# EAGLE design combo - no usb - pth - tcrt5000 (EAGLE 6.5.0)
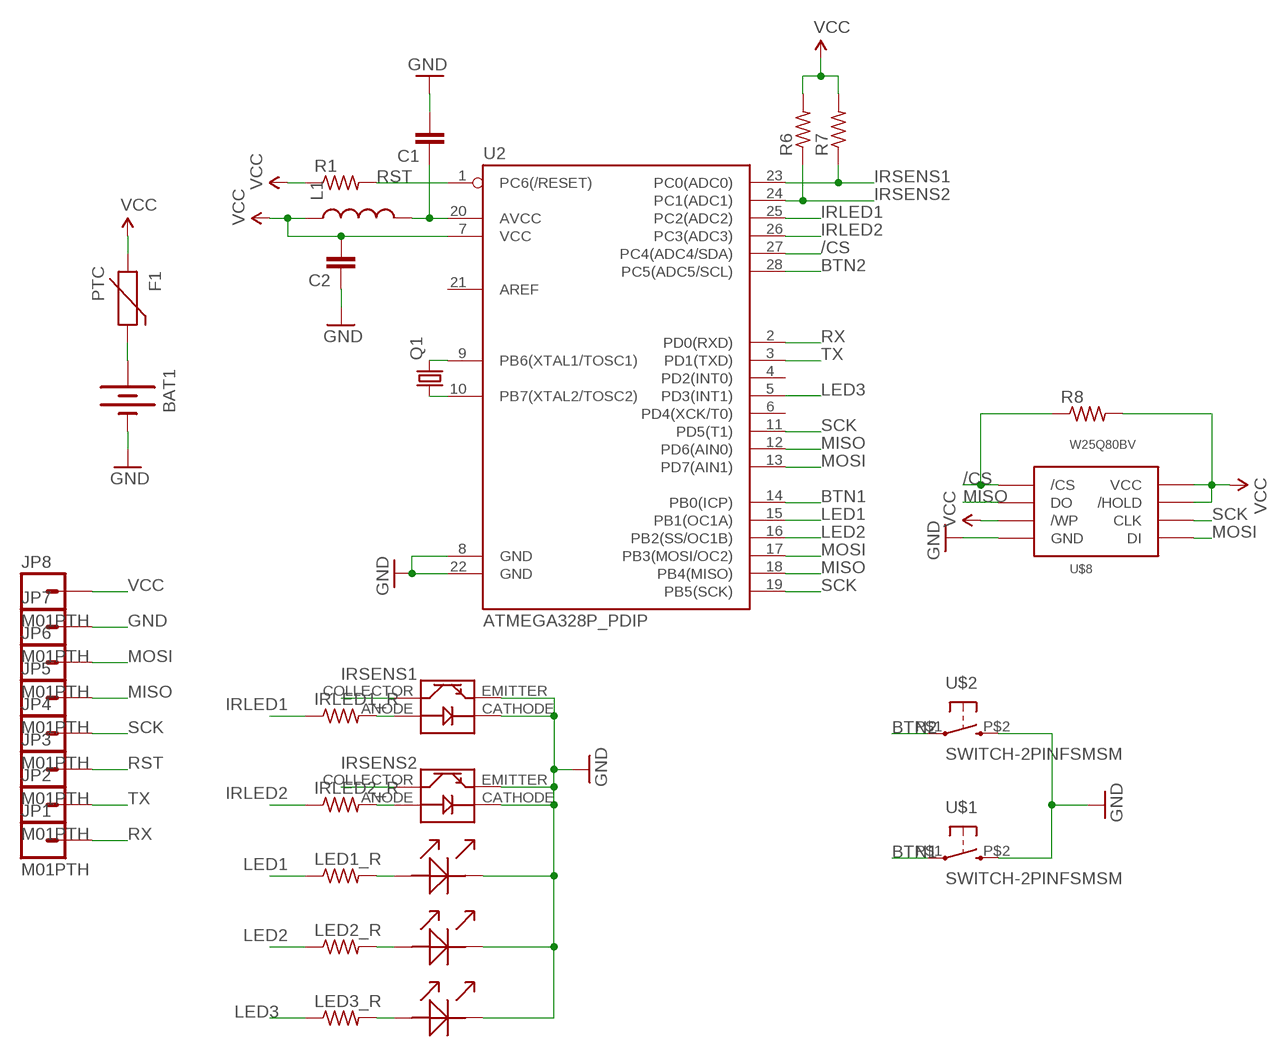
[diagram p0: schematic, sheet 1]

## Parts
BAT1  BATTERYBA2032SM  [BA2032SM]
C1  CAP0805  [0805]
C2  CAP0805  [0805]
F1  PTC  [R0805]
IRLED1_R  R-US_M0805  [M0805]
IRLED2_R  R-US_M0805  [M0805]
JP1  M01PTH  [1X01]
JP2  M01PTH  [1X01]
JP3  M01PTH  [1X01]
JP4  M01PTH  [1X01]
JP5  M01PTH  [1X01]
JP6  M01PTH  [1X01]
JP7  M01PTH  [1X01]
JP8  M01PTH  [1X01]
L1  INDUCTOR0805  [0805]
LED1_R  R-US_M0805  [M0805]
LED2_R  R-US_M0805  [M0805]
LED3_R  R-US_M0805  [M0805]
Q1  CRYSTALTC26V  [TC26V]
R1  R-US_M0805  [M0805]
R6  R-US_M0805  [M0805]
R7  R-US_M0805  [M0805]
R8  R-US_M0805  [M0805]
U2  ATMEGA328P_PDIP  [DIL28-3]
U$1  SWITCH-2PINFSMSM  [FSMSM-BUTTON]
U$2  SWITCH-2PINFSMSM  [FSMSM-BUTTON]
U$3  IR_SENSORTCRT5000  [TCRT5000]
U$4  IR_SENSORTCRT5000  [TCRT5000]
U$5  LEDPTH  [LED]
U$6  LEDPTH  [LED]
U$7  LED0603  [0603]
U$8  W25Q80BVSOIC-08  [W25Q80BV-SOIC-208MIL]

## Nets
/CS: R8.1 U2.27(PC4(ADC4/SDA)) U$8./CS
BTN1: U2.14(PB0(ICP)) U$1.P$1
BTN2: U2.28(PC5(ADC5/SCL)) U$2.P$1
GND: BAT1.- C1.2 C2.1 JP7.1 U2.8(GND) U2.22(GND) U$1.P$2 U$2.P$2 U$3.CATHODE(LED-) U$3.EMITTER U$4.CATHODE(LED-) U$4.EMITTER U$5.- U$6.- U$7.2(-) U$8.GND
IRLED1: IRLED1_R.1 U2.25(PC2(ADC2))
IRLED2: IRLED2_R.1 U2.26(PC3(ADC3))
IRSENS1: R7.1 U2.23(PC0(ADC0)) U$3.COLLECTOR
IRSENS2: R6.1 U2.24(PC1(ADC1)) U$4.COLLECTOR
LED1: LED1_R.1 U2.15(PB1(OC1A))
LED2: LED2_R.1 U2.16(PB2(SS/OC1B))
LED3: LED3_R.1 U2.5(PD3(INT1))
MISO: JP5.1 U2.12(PD6(AIN0)) U2.18(PB4(MISO)) U$8.DO
MOSI: JP6.1 U2.13(PD7(AIN1)) U2.17(PB3(MOSI/OC2)) U$8.DI
N$1: BAT1.+ F1.2
N$4: Q1.2 U2.9(PB6(XTAL1/TOSC1))
N$5: Q1.1 U2.10(PB7(XTAL2/TOSC2))
N$6: C1.1 L1.2 U2.20(AVCC)
N$7: LED3_R.2 U$7.1(+)
N$13: LED2_R.2 U$6.+
N$14: LED1_R.2 U$5.+
N$15: IRLED2_R.2 U$4.ANODE(LED+)
N$16: IRLED1_R.2 U$3.ANODE(LED+)
RST: JP3.1 R1.2 U2.1(PC6(/RESET))
RX: JP1.1 U2.2(PD0(RXD))
SCK: JP4.1 U2.11(PD5(T1)) U2.19(PB5(SCK)) U$8.CLK
TX: JP2.1 U2.3(PD1(TXD))
VCC: C2.2 F1.1 JP8.1 L1.1 R1.1 R6.2 R7.2 R8.2 U2.7(VCC) U$8./HOLD U$8./WP U$8.VCC
Unconnected: U2.4(PD2(INT0)) U2.6(PD4(XCK/T0)) U2.21(AREF)

## Library data of the parts
BAT1 = Mine:BATTERY: Battery Holders Various common sizes : AA, AAA, 20mm coin cell and 12mm coin cell.
C1 C2 = SparkFun-Capacitors:CAP: Capacitor Standard 0603 ceramic capacitor, and 0.1" leaded capacitor.
F1 = Mine:PTC: Resettable Fuse PTC Resettable Fuse. Spark Fun Electronics SKU : COM-08357
IRLED1_R IRLED2_R LED1_R LED2_R LED3_R R1 R6-R8 = rcl:R-US_: RESISTOR, American symbol
JP1-JP8 = SparkFun-Connectors:M01: Header 1 Standard 1-pin 0.1" header. Use with straight break away headers (SKU : PRT-00116), right angle break away headers (PRT-00553), swiss pins (PRT-00743), machine pins (PRT-00117), and female headers (PRT-00115).
L1 = SparkFun-Passives:INDUCTOR: Inductors Basic Inductor/Choke - 0603 and 1206. Footprints are not proven and vary greatly between part numbers. SRN6045- 33uH, 20% 1.4A SDR0403-560KL - 56uH, 10%, 500mA RMS/740mA peak
Q1 = crystal:CRYSTAL: CRYSTAL; OC_FARNELL: unknown; OC_NEWARK: unknown
U2 = SparkFun-DigitalIC:ATMEGA328P_PDIP: uC used in the Arduino 32kb flash, 1k EEPROM, 2k SRAM This is the through-hole version of this chip.
U$1 U$2 = Mine:SWITCH-2PIN
U$3 U$4 = Mine:IR_SENSOR
U$5-U$7 = Mine:LED
U$8 = Mine:W25Q80BV

## Board
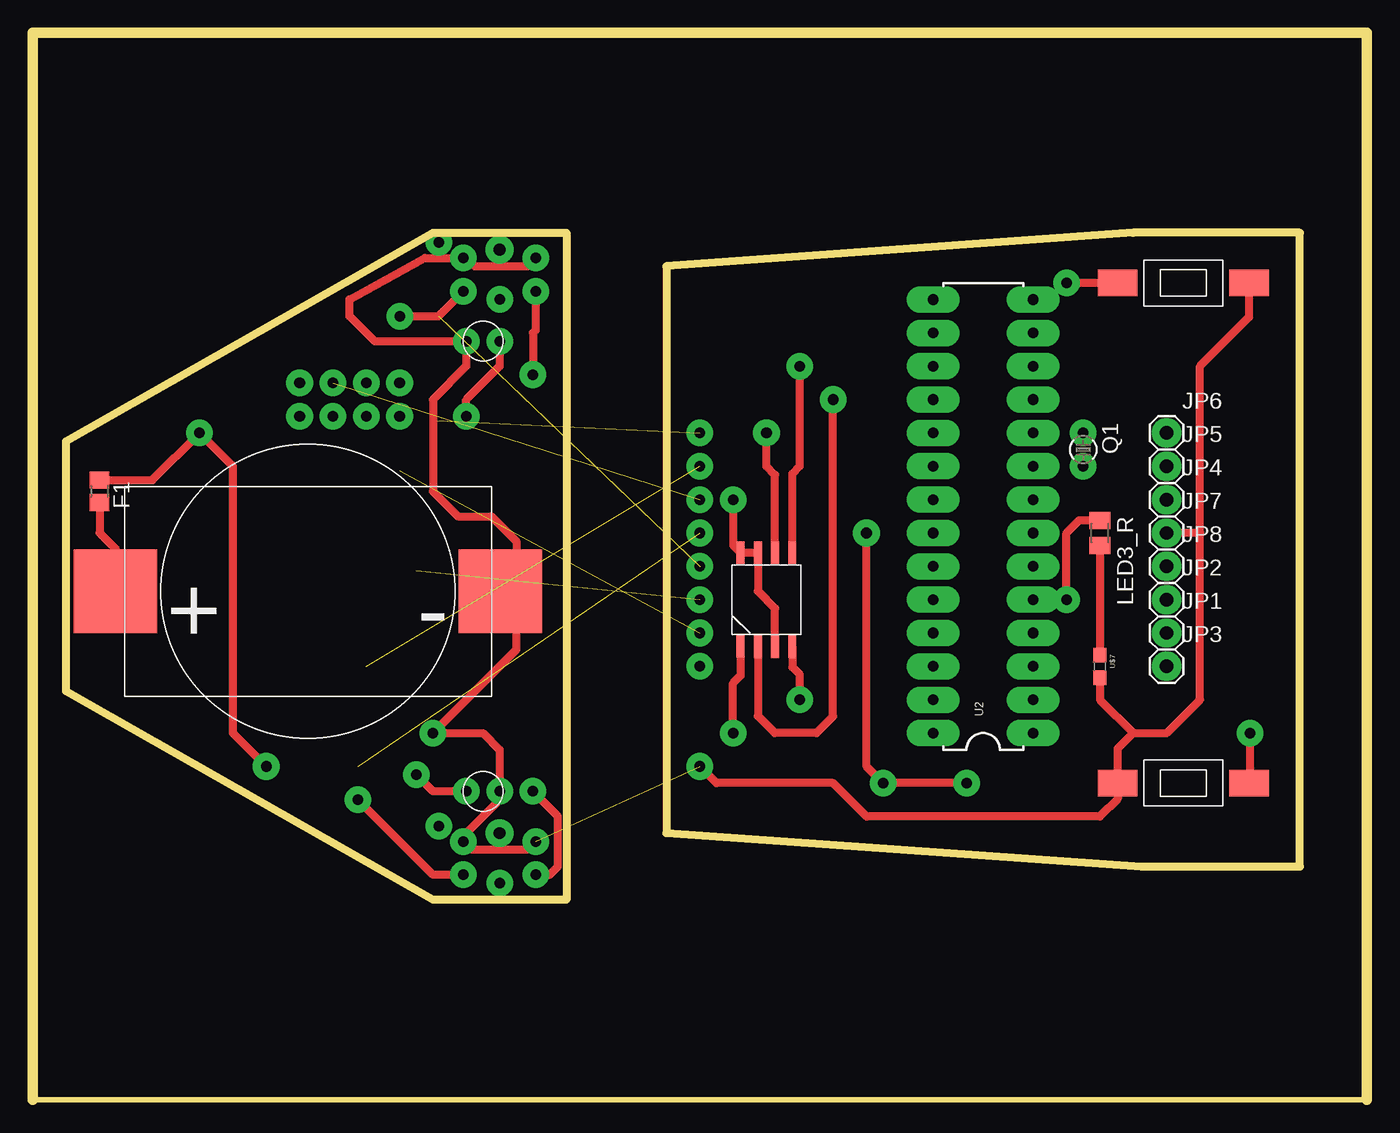
[diagram p1: board, top side]
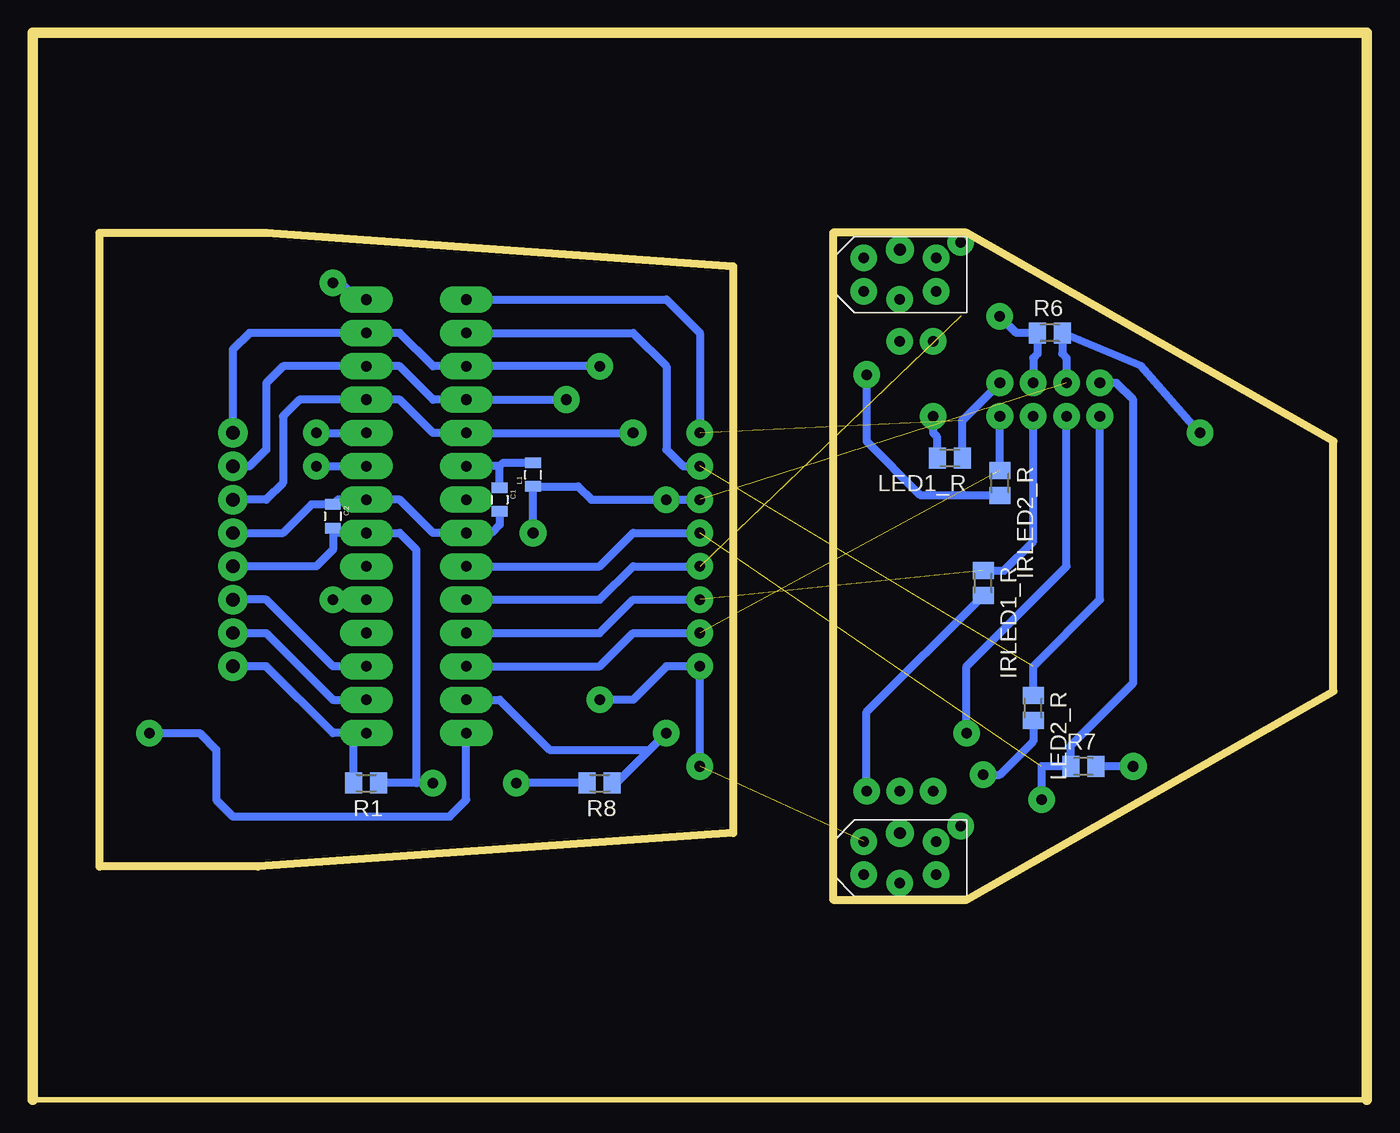
[diagram p2: board, bottom side, seen from below]

Size 101.6 x 81.28 mm. Coordinates in mm from the lower left corner, seen from the top.
Outline: 40.64,66.04 40.64,15.24 30.48,15.24 2.54,31.11 2.54,50.16 30.48,66.04 40.64,66.04
Outline: 48.26,63.5 48.26,20.32 84.45,17.78 96.52,17.78 96.52,66.04 83.82,66.04 48.26,63.5
Outline: 0,0 0,81.28 101.6,81.28 101.6,0 0,0
Copper layers (1*16): Top 0.035mm / dielectric 1.5mm / Bottom 0.035mm
Design rules "default *": minimum track width 20mil, minimum drill 30mil, track to track 32mil, track to pad 32mil, pad to pad 16mil, via to via 32mil, smd to smd 8mil, copper to edge 40mil, drill to drill 8mil, minimum pad ring 24mil, minimum via ring 24mil, stop-mask expansion 4mil, vias tented up to drill 0mil, thermal gap 10mil

### Footprints (pad centres in the part's own frame; a part is rotated, then mirrored left to right if it is on the bottom)
BA2032SM = smd 6.35 x 6.35: + 14.656,0; - -14.656,0
0805 = smd 0.8 x 1.2: 1 -0.9,0; 2 0.9,0
R0805 = smd 1.3 x 1.5: 1 -0.85,0; 2 0.85,0
M0805 = smd 1.3 x 1.6: 1 -0.95,0; 2 0.95,0
1X01 = drill 1.016 pad 1.88: 1 0,0
TC26V = drill 0.813: 1 -1.27,0; 2 1.27,0
DIL28-3 = drill 0.813 long: 1 -16.51,-3.81; 2 -13.97,-3.81; 3 -11.43,-3.81; 4 -8.89,-3.81; 5 -6.35,-3.81; 6 -3.81,-3.81; 7 -1.27,-3.81; 8 1.27,-3.81; 9 3.81,-3.81; 10 6.35,-3.81; 11 8.89,-3.81; 12 11.43,-3.81; 13 13.97,-3.81; 14 16.51,-3.81; 15 16.51,3.81; 16 13.97,3.81; 17 11.43,3.81; 18 8.89,3.81; 19 6.35,3.81; 20 3.81,3.81; 21 1.27,3.81; 22 -1.27,3.81; 23 -3.81,3.81; 24 -6.35,3.81; 25 -8.89,3.81; 26 -11.43,3.81; 27 -13.97,3.81; 28 -16.51,3.81
FSMSM-BUTTON = smd 3 x 2: P$1 5,0; P$2 -5,0
TCRT5000 = drill 0.8 pad 1.676: ANODE 2.75,1.27; CATHODE 2.75,-1.27; COLLECTOR -2.75,1.27; EMITTER -2.75,-1.27 | drill 0.8 pad 0.965: P$5 0,1.9; P$7 -4.65,-2.45 | drill 0.9 pad 0.965: P$6 0,-1.9
LED = drill 0.8 pad 1.676: + -1.27,0; - 1.27,0
0603 = smd 1.1 x 1: 1 -0.85,0; 2 0.85,0
W25Q80BV-SOIC-208MIL = smd 1.7 x 0.605: /CS -3.567,1.965 | smd 1.7 x 0.6: /HOLD 3.575,0.655; /WP -3.575,-0.655; CLK 3.575,-0.655; DI 3.575,-1.965; DO -3.575,0.655; GND -3.575,-1.965; VCC 3.575,1.965

### Placement (x,y rotation side)
BAT1  20.95,38.73 180 top
C1  66.04,45.72 270 bottom
C2  78.74,44.45 270 bottom
F1  5.08,46.35 270 top
IRLED1_R  29.21,39.37 270 bottom
IRLED2_R  27.94,46.99 270 bottom
JP1  86.36,35.56 0 top
JP2  86.36,38.1 0 top
JP3  86.36,33.02 0 top
JP4  86.36,45.72 0 top
JP5  86.36,48.26 0 top
JP6  86.36,50.8 0 top
JP7  86.36,43.18 0 top
JP8  86.36,40.64 0 top
L1  63.5,47.62 90 bottom
LED1_R  31.75,48.9 180 bottom
LED2_R  25.4,29.84 270 bottom
LED3_R  81.28,43.18 270 top
Q1  80.01,49.53 270 top
R1  76.2,24.13 180 bottom
R6  24.13,58.42 0 bottom
R7  21.59,25.4 0 bottom
R8  58.42,24.13 180 bottom
U2  72.39,44.45 90 top
U$1  87.63,62.23 180 top
U$2  87.63,24.13 0 top
U$3  35.56,18.41 180 bottom
U$4  35.56,62.87 180 bottom
U$5  34.29,57.78 180 top
U$6  34.29,23.5 0 top
U$7  81.28,33.02 270 top
U$8  55.88,38.1 90 top

### Tracks (layer width: path | path; a pad name or v marks a point on that pad's centre or on a via)
/CS  (via drill 0.81)
  Top 0.61: U$8./CS 53.91,32.33 53.34,31.75 v53.34,27.94
  Bottom 0.61: U2.27 66.04,30.48 62.23,26.67 54.61,26.67 | 54.61,26.67 v53.34,27.94 | R8.1 57.15,24.13 54.61,26.67
BTN1  (via drill 0.81)
  Top 0.61: U$1.P$1 v78.74,62.23
  Bottom 0.61: U2.14 76.83,60.96 78.11,62.23 v78.74,62.23
BTN2  (via drill 0.81)
  Top 0.61: v92.71,27.94 92.71,24.21 U$2.P$1
  Bottom 0.61: U2.28 68.58,22.86 69.85,21.59 86.36,21.59 87.63,22.86 87.63,26.67 88.9,27.94 v92.71,27.94
GND  (via drill 0.81)  (1 unrouted)
  Top 0.61: v50.8,25.4 52.07,24.13 60.96,24.13 63.5,21.59 81.28,21.59 82.63,22.94 U$2.P$2 82.63,26.75 83.82,27.94 | U$8.GND 57.84,32.96 58.42,32.38 v58.42,30.48 | 88.9,43.18 88.9,30.48 86.36,27.94 83.82,27.94 | 88.9,43.18 88.9,55.88 92.63,59.61 U$1.P$2 | 88.9,43.18 JP7.1 | 36.83,38.1 36.83,42.55 34.92,44.45 32.38,44.45 30.48,46.35 30.48,53.34 33.02,55.88 U$5.- 26.04,57.78 24.13,59.69 24.13,60.96 29.84,64.14 U$4.EMITTER 33.02,64.14 33.66,63.5 37.67,63.5 U$4.CATHODE | 36.83,38.1 36.83,34.29 v30.48,27.94 34.29,27.94 35.56,26.67 U$6.- 35.56,22.86 32.81,20.11 U$3.EMITTER 33.45,19.05 37.67,19.05 U$3.CATHODE | U$7.2 81.28,30.48 83.82,27.94 | 36.83,38.1 36.25,38.1 BAT1.-
  Bottom 0.61: v50.8,25.4 v50.8,33.02 53.34,33.02 55.88,30.48 v58.42,30.48 | v30.48,27.94 30.48,33.02 22.86,40.64 v22.86,52.07 | C1.2 66.04,43.81 66.67,43.18 U2.22 71.12,43.18 73.66,45.72 U2.8 78.37,45.72 C2.1 80.38,45.35 82.55,43.18 JP7.1
IRLED1  (via drill 0.81)  (1 unrouted)
  Bottom 0.61: U2.25 58.42,35.56 55.88,38.1 v50.8,38.1 | v25.4,52.07 25.4,42.55 27.62,40.32 IRLED1_R.1
IRLED2  (via drill 0.81)  (1 unrouted)
  Bottom 0.61: U2.26 58.42,33.02 55.88,35.56 v50.8,35.56 | IRLED2_R.1 v27.94,52.07
IRSENS1  (via drill 0.8, 0.81)  (1 unrouted)
  Top 0.61: U$3.COLLECTOR 30.48,17.14 v24.77,22.86
  Bottom 0.61: U2.23 58.42,40.64 55.88,43.18 v50.8,43.18 | v20.32,54.61 19.05,54.61 17.78,53.34 17.78,31.75 22.54,26.99 R7.1 24.77,25.4 v24.77,22.86
IRSENS2  (via drill 0.8, 0.81)  (1 unrouted)
  Top 0.61: v27.94,59.69 30.91,59.69 U$4.COLLECTOR
  Bottom 0.61: U2.24 58.42,38.1 55.88,40.64 v50.8,40.64 | v25.4,54.61 25.4,56.52 25.08,56.84 R6.1 26.67,58.42 v27.94,59.69
LED1  (via drill 0.81)  (1 unrouted)
  Bottom 0.61: U2.15 53.34,60.96 50.8,58.42 v50.8,50.8 | v27.94,54.61 30.8,51.75 LED1_R.1 30.48,49.22
LED2  (via drill 0.81)  (1 unrouted)
  Bottom 0.61: U2.16 55.88,58.42 53.34,55.88 53.34,49.53 52.07,48.26 v50.8,48.26 | LED2_R.1 25.4,33.02 20.32,38.1 v20.32,52.07
LED3  (via drill 0.8)
  Top 0.61: v78.74,38.1 78.74,43.18 79.69,44.13 LED3_R.1
  Bottom 0.61: U2.5 v78.74,38.1
MISO  (via drill 0.81)
  Top 0.61: U$8.DO 55.23,29.23 56.52,27.94 59.69,27.94 60.96,29.21 v60.96,53.34
  Bottom 0.61: v60.96,53.34 U2.18 71.12,53.34 73.66,55.88 U2.12 82.55,55.88 83.82,54.61 83.82,49.53 85.09,48.26 JP5.1
MOSI  (via drill 0.81)
  Top 0.61: U$8.DI 57.84,47.69 58.42,48.26 v58.42,55.88
  Bottom 0.61: v58.42,55.88 U2.17 71.12,55.88 73.66,58.42 U2.13 85.09,58.42 86.36,57.15 JP6.1
N$1
  Top 0.61: F1.2 5.08,43.18 6.35,41.91 6.35,38.68 BAT1.+
N$4
  Bottom 0.61: Q1.2 U2.9
N$5
  Bottom 0.61: Q1.1 U2.10
N$6
  Bottom 0.61: 66.04,48.26 U2.20 | C1.1 66.04,48.26 | L1.2 65.78,48.52 66.04,48.26
N$7
  Top 0.61: LED3_R.2 U$7.1
N$13  (via drill 0.8)
  Top 0.61: U$6.+ 30.48,23.5 v29.21,24.77
  Bottom 0.61: LED2_R.2 25.4,27.3 27.94,24.77 v29.21,24.77
N$14  (via drill 0.8)
  Top 0.61: v33.02,52.07 33.02,53.34 35.56,55.88 U$5.+
  Bottom 0.61: LED1_R.2 32.7,50.48 33.02,50.8 v33.02,52.07
N$15  (via drill 0.8)
  Top 0.61: U$4.ANODE 38.31,58.63 38.1,58.42 v38.1,55.24
  Bottom 0.61: IRLED2_R.2 33.98,46.04 38.1,50.16 v38.1,55.24
N$16  (via drill 0.8)
  Top 0.61: U$3.ANODE 39.37,17.14 40.01,17.78 40.01,21.59 v38.1,23.5
  Bottom 0.61: v38.1,23.5 38.1,29.53 IRLED1_R.2
RST
  Bottom 0.61: U2.1 76.83,27.94 | 76.83,27.94 78.74,27.94 83.82,33.02 JP3.1 | R1.2 77.15,27.62 76.83,27.94
RX
  Bottom 0.61: U2.2 78.74,30.48 83.82,35.56 JP1.1
SCK  (via drill 0.81)
  Top 0.61: U$8.CLK 56.53,47.6 55.88,48.26 v55.88,50.8
  Bottom 0.61: v55.88,50.8 U2.19 71.12,50.8 73.66,53.34 U2.11 81.28,53.34 82.55,52.07 82.55,46.99 83.82,45.72 JP4.1
TX
  Bottom 0.61: U2.3 78.74,33.02 83.82,38.1 JP2.1
VCC  (via drill 0.8, 0.81)  (1 unrouted)
  Top 0.61: v71.12,24.13 v64.77,24.13 63.5,25.4 v63.5,43.18 | F1.1 9.11,47.2 v12.7,50.8 15.24,48.26 15.24,27.94 v17.78,25.4 | v53.34,45.72 53.34,42.25 U$8.VCC U$8./HOLD 55.23,38.76 56.53,37.45 U$8./WP
  Bottom 0.61: v50.8,45.72 v53.34,45.72 59.05,45.72 60.06,46.73 L1.1 v63.5,43.18 | v71.12,24.13 72.39,24.13 | 72.39,24.13 R1.1 | 72.39,24.13 72.39,41.91 73.66,43.18 U2.7 78.37,43.18 C2.2 78.74,41.91 80.01,40.64 JP8.1 | v17.78,25.4 R7.2 | R8.2 v64.77,24.13 | v12.7,50.8 17.14,55.88 R6.2 23.18,56.84 22.86,56.52 v22.86,54.61